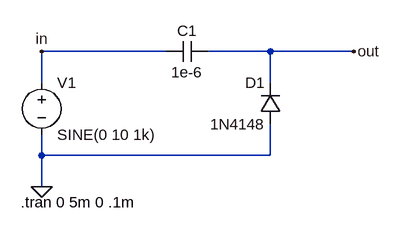
[diagram p0: schematic Sim_1_3.asc]
Sim_1_3.asc, the LTspice schematic file:
Version 4
SHEET 1 880 680
WIRE 16 -80 -176 -80
WIRE 176 -80 80 -80
WIRE 304 -80 176 -80
WIRE -176 -32 -176 -80
WIRE 176 -32 176 -80
WIRE -176 80 -176 48
WIRE 176 80 176 32
WIRE 176 80 -176 80
WIRE -176 128 -176 80
FLAG -176 128 0
FLAG -176 -80 in
FLAG 304 -80 out
SYMBOL voltage -176 -48 R0
WINDOW 123 0 0 Left 0
WINDOW 39 0 0 Left 0
SYMATTR InstName V1
SYMATTR Value SINE(0 10 1k)
SYMBOL diode 192 32 R180
WINDOW 0 24 64 Left 2
WINDOW 3 24 0 Left 2
SYMATTR InstName D1
SYMATTR Value 1N4148
SYMBOL cap 80 -96 R90
WINDOW 0 0 32 VBottom 2
WINDOW 3 32 32 VTop 2
SYMATTR InstName C1
SYMATTR Value 1e-6
TEXT -208 152 Left 2 !.tran 0 5m 0 .1m

The netlist it stands for:
* Sim_1_3.asc
V1 in 0 SINE(0 10 1k)
D1 0 out 1N4148
C1 out in 1e-6
.model D D
.lib standard.dio
.tran 0 5m 0 .1m
.backanno
.end

* Results of the author's LTspice run, read from the files saved beside the schematic
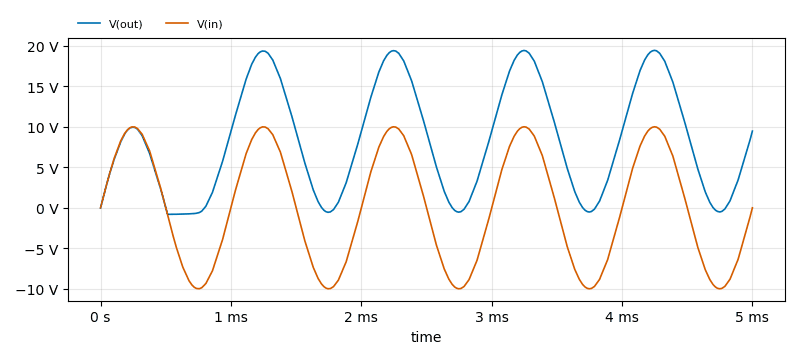
[diagram p1: Transient Analysis of Sim_1_3.asc, plotted from the saved traces]
* Transient Analysis, 1 run:
*   V(out): min -806.6 mV, max 19.43 V, average 8.296 V, rms 10.82 V, last 9.468 V
*   V(in): min -10 V, max 10 V, average 368.6 µV, rms 7.171 V, last 0 V